# EAGLE design vssb3 (EAGLE 7.1.0)
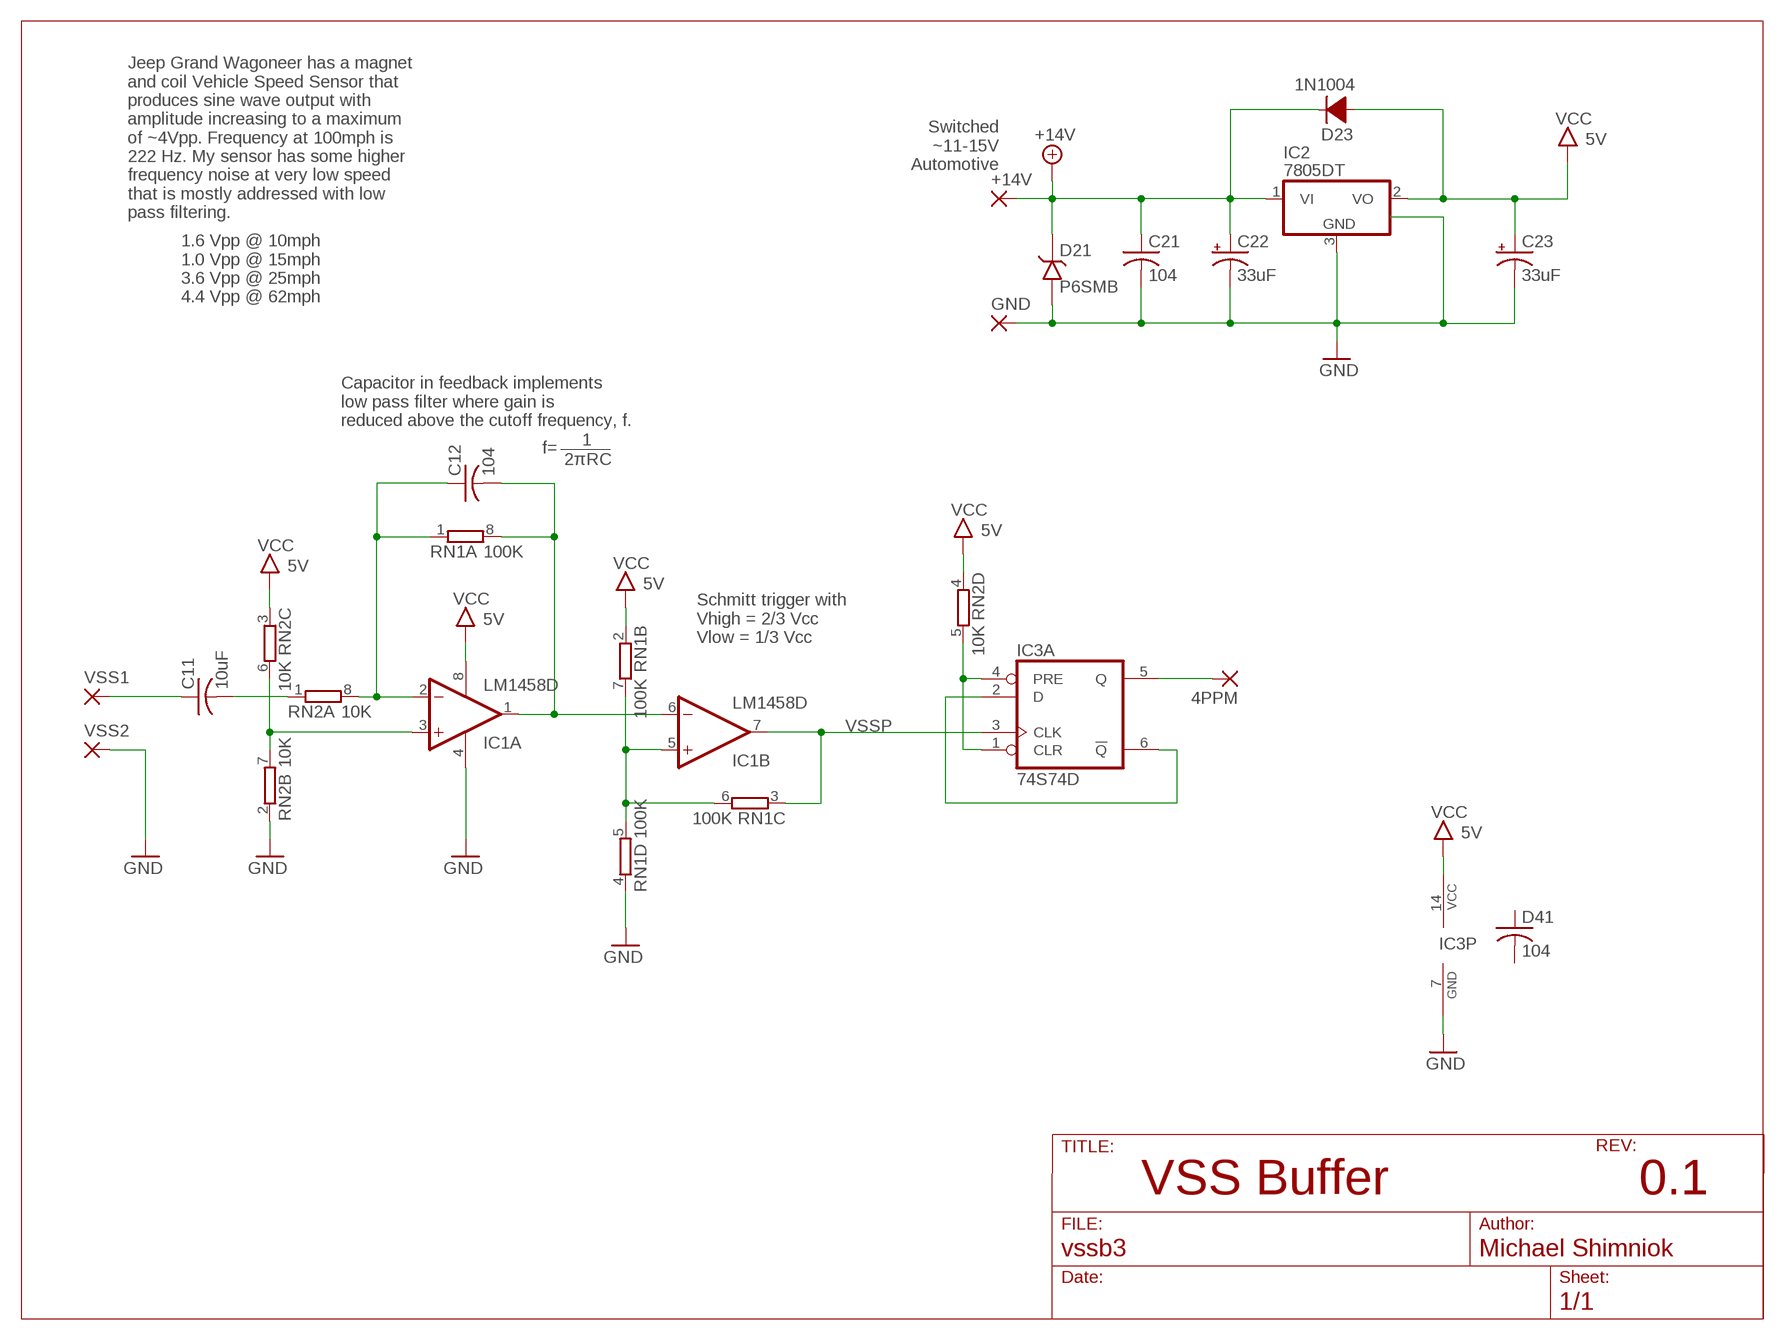
[diagram p0: schematic, sheet 1]

## Parts
4PPM  WIREPAD3,17/1,3  [3,17/1,3]
+14V  WIREPAD3,17/1,3  [3,17/1,3]
C11  10uF  C-USC1206  [C1206]
C12  104  C-USC0603  [C0603]
C21  104  C-USC0603  [C0603]
C22  33uF  CPOL-USSMCB  [SMC_B]
C23  33uF  CPOL-USSMCB  [SMC_B]
D21  P6SMB  P6SMBXXAT3GSMA  [DO-214AA]
D23  1N1004  DIODESMA  [SMA]
D41  104  C-USC0603  [C0603]
GND  WIREPAD3,17/1,3  [3,17/1,3]
IC1  LM1458D  [SO08]
IC2  7805DT  [TO252]
IC3  74S74D  [SO14]
RN1  100K  4R-NEXB38V  [EXB38V]
RN2  10K  4R-NEXB38V  [EXB38V]
VSS1  WIREPAD3,17/1,3  [3,17/1,3]
VSS2  WIREPAD3,17/1,3  [3,17/1,3]

## Nets
4PPM: 4PPM.1(P) IC3.5(A:Q)
+14V: +14V.1(P) C21.1 C22.+ D21.P$1(C) D23.C IC2.1(VI)
GND: C21.2 C22.- C23.- D21.P$2(A) GND.1(P) IC1.4(P:V-) IC2.3(GND) IC3.7(P:GND) RN1.4 RN2.2 VSS2.1(P)
N$1: C11.2 RN2.1
N$2: C12.1 IC1.2(A:-IN) RN1.1 RN2.8
N$3: IC1.3(A:+IN) RN2.6 RN2.7
N$4: IC1.5(B:+IN) RN1.5 RN1.6 RN1.7
N$5: IC3.2(A:D) IC3.6(A:!Q)
N$6: IC3.1(A:CLR) IC3.4(A:PRE) RN2.5
OUT1: C12.2 IC1.1(A:OUT) IC1.6(B:-IN) RN1.8
VCC: C23.+ D23.A IC1.8(P:V+) IC2.2(VO) IC3.14(P:VCC) RN1.2 RN2.3 RN2.4 ; supply symbol labelled 5V
VSS1: C11.1 VSS1.1(P)
VSSP: IC1.7(B:OUT) IC3.3(A:CLK) RN1.3
Unconnected: D41.1 D41.2 IC3.8(B:!Q) IC3.9(B:Q) IC3.10(B:PRE) IC3.11(B:CLK) IC3.12(B:D) IC3.13(B:CLR)

## Notes on the sheet
- Jeep Grand Wagoneer has a magnet 
  and coil Vehicle Speed Sensor that
  produces sine wave output with
  amplitude increasing to a maximum
  of ~4Vpp. Frequency at 100mph is
  222 Hz. My sensor has some higher
  frequency noise at very low speed
  that is mostly addressed with low
  pass filtering.
- Switched
  ~11-15V
  Automotive
- 1.6 Vpp @ 10mph
  1.0 Vpp @ 15mph
  3.6 Vpp @ 25mph
  4.4 Vpp @ 62mph
- Capacitor in feedback implements
  low pass filter where gain is
  reduced above the cutoff frequency, f.
- 1
- f=
- 2πRC
- Schmitt trigger with 
  Vhigh = 2/3 Vcc
  Vlow = 1/3 Vcc
- VSS Buffer | 0.1

## Library data of the parts
4PPM +14V GND VSS1 VSS2 = wirepad:WIREPAD: Wire PAD connect wire on PCB
C11 C12 C21 D41 = rcl:C-US: CAPACITOR, American symbol
C22 C23 = rcl:CPOL-US: POLARIZED CAPACITOR, American symbol
D21 = bt_diode:P6SMBXXAT3G: SMBxxAT3G TVS Diode The SMB series is designed to protect voltage sensitive components from high voltage, high energy transients. They have excellent clamping capability, high surge capability, low zener impedance and fast response time. The SMB series is supplied in ON Semiconductor’s exclusive, cost-effective, highly reliable SURMETIC® package and is ideally suited for use in communication systems, automotive, numerical controls, process controls, medical equipment, business machines, power supplies and many other industrial/consumer applications. http://www.onsemi.com/pub_link/Collateral/P6SMB6.8AT3-D.PDF <datasheet.pdf>
D23 = ads4:DIODE: Diode Contains packages not in Eagle libraries
IC1 = bt_linear:*1458: OP AMP
IC2 = linear:78*: Positive VOLTAGE REGULATOR Source: http://cache.national.com/ds/LM/LM78L05.pdf http://www.fairchildsemi.com/ds/LM/LM7805.pdf
IC3 = 74xx-us:74*74: Dual D type positive edge triggered FLIP FLOP, preset and clear
RN1 RN2 = resistor-dil:4R-N: Array Chip Resistor Source: RS Component / Phycomp; OC_FARNELL: unknown; OC_NEWARK: unknown

## Board
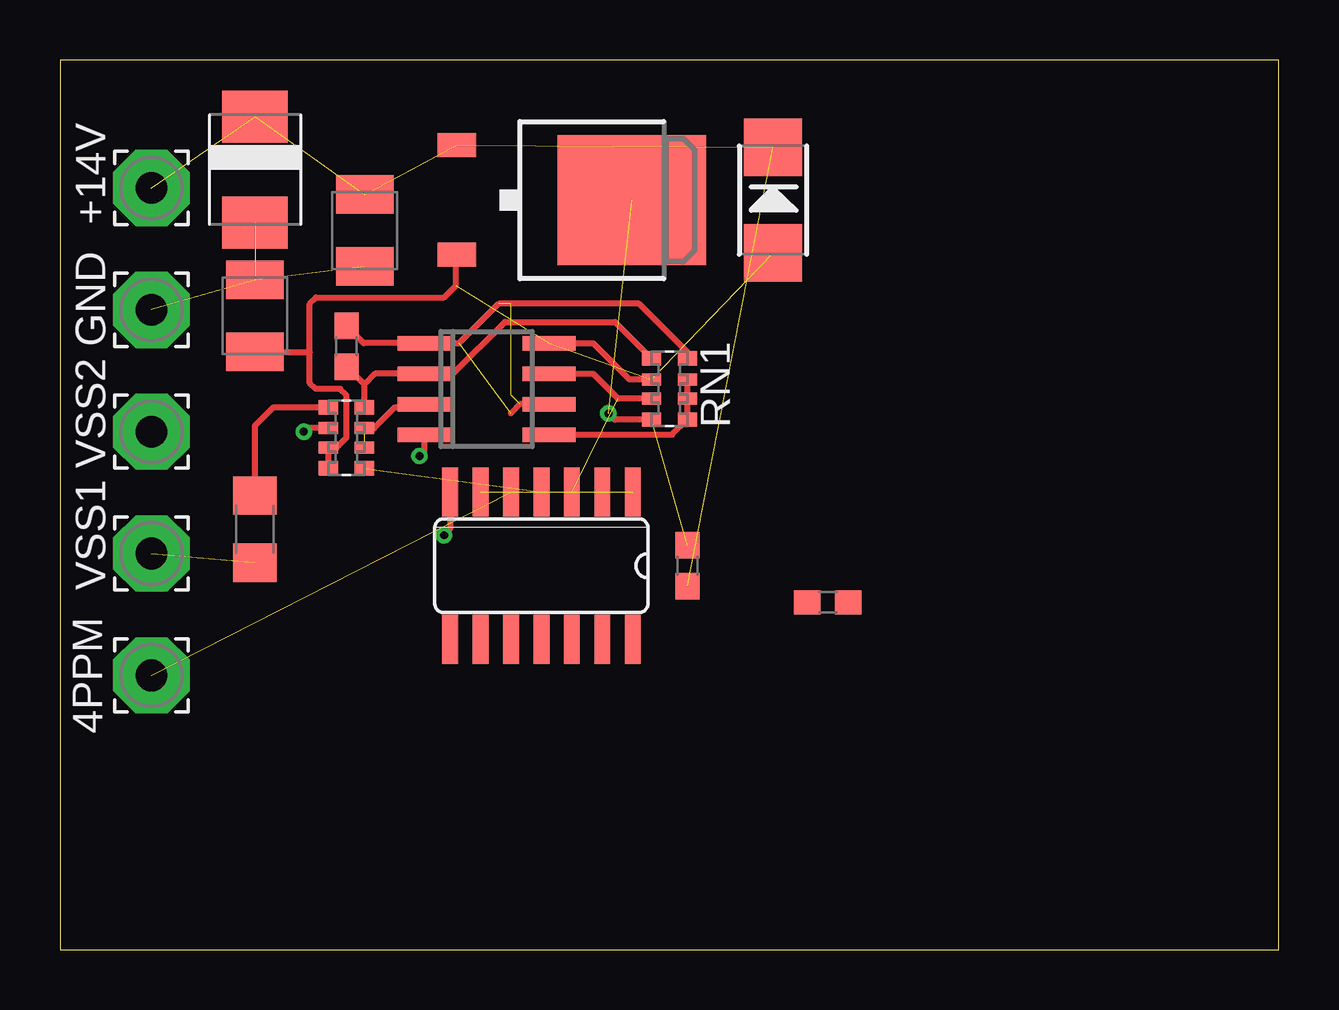
[diagram p1: board, top side]
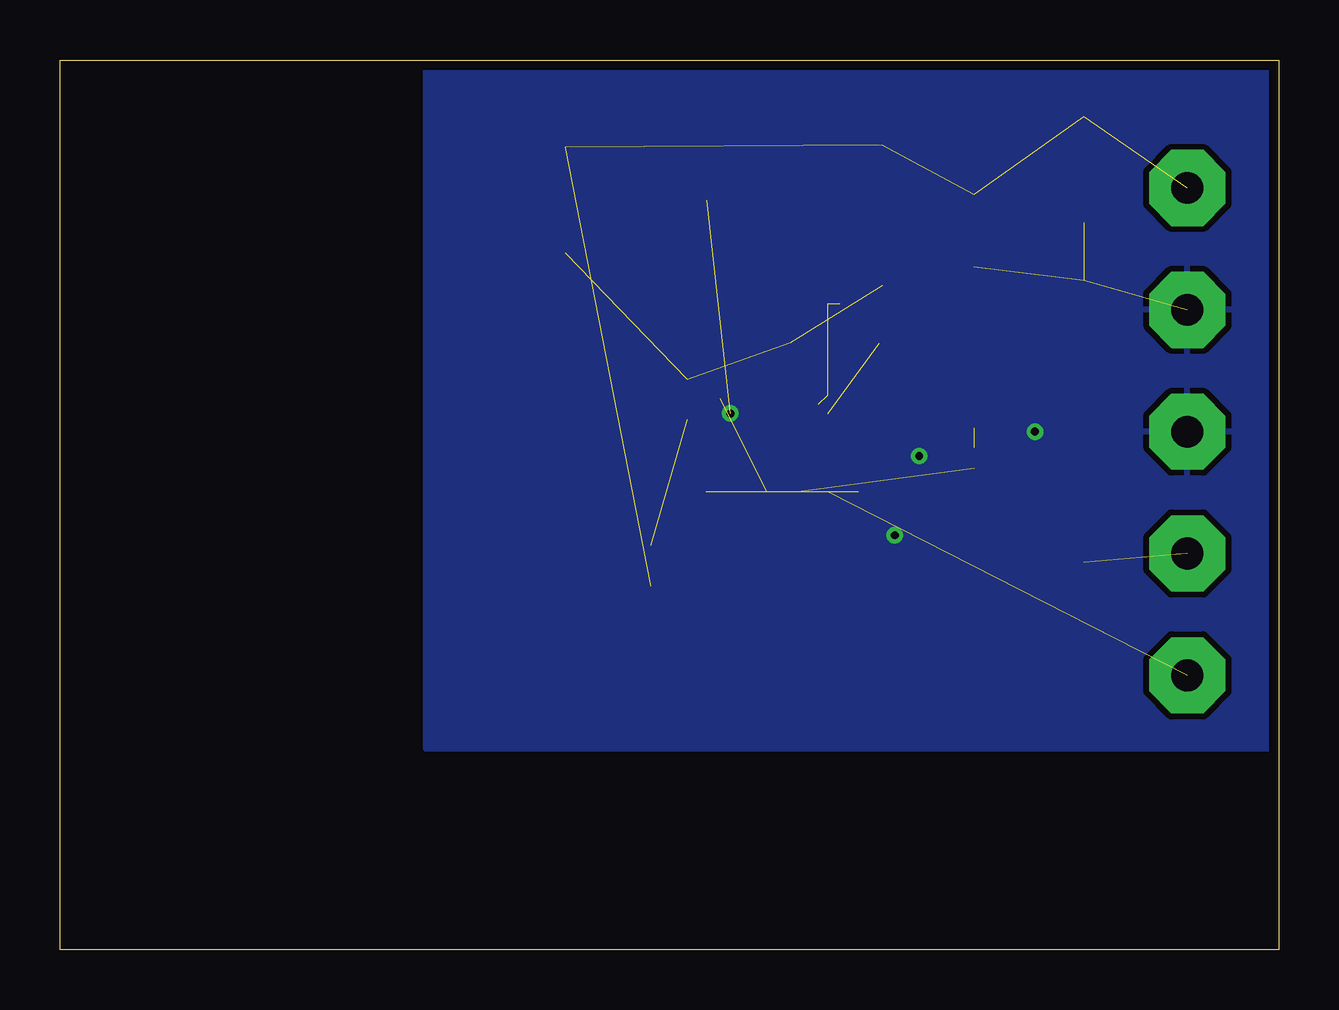
[diagram p2: board, bottom side, seen from below]

Size 50.8 x 37.08 mm. Coordinates in mm from the lower left corner, seen from the top.
Outline: 0,0 50.8,0 50.8,37.08 0,37.08 0,0
Copper layers (1*16): Top 0.0356mm / dielectric 1.5011mm / Bottom 0.0356mm
Design rules "LaenPCBOrder *": minimum track width 6mil, minimum drill 13mil, track to track 10mil, track to pad 10mil, pad to pad 10mil, via to via 10mil, smd to smd 8mil, copper to edge 16mil, drill to drill 16mil, minimum pad ring 7mil, minimum via ring 7mil, stop-mask expansion 3mil, vias tented up to drill 20mil, thermal gap 10mil

### Footprints (pad centres in the part's own frame; a part is rotated, then mirrored left to right if it is on the bottom)
3,17/1,3 = drill 1.321 pad 3.175 octagon: 1 0,0
C1206 = smd 1.6 x 1.8: 1 -1.4,0; 2 1.4,0
C0603 = smd 1.1 x 1: 1 -0.85,0; 2 0.85,0
SMC_B = smd 1.6 x 2.4: + -1.5,0; - 1.5,0
DO-214AA = smd 2.159 x 2.743: P$1 -2.21,0; P$2 2.21,0
SMA = smd 2.4 x 2.4: A 2.2,0; C -2.2,0
SO08 = smd 0.6 x 2.2: 1 -1.905,-2.6; 2 -0.635,-2.6; 3 0.635,-2.6; 4 1.905,-2.6; 5 1.905,2.6; 6 0.635,2.6; 7 -0.635,2.6; 8 -1.905,2.6
TO252 = smd 1 x 1.6: 1 -2.28,-4.8; 2 2.28,-4.8 | smd 5.4 x 6.2: 3 0,2.5
SO14 = smd 0.66 x 2.032: 1 -3.81,-3.073; 2 -2.54,-3.073; 3 -1.27,-3.073; 4 0,-3.073; 5 1.27,-3.073; 6 2.54,-3.073; 7 3.81,-3.073; 8 3.81,3.073; 9 2.54,3.073; 10 1.27,3.073; 11 0,3.073; 12 -1.27,3.073; 13 -2.54,3.073; 14 -3.81,3.073
EXB38V = smd 0.6 x 0.8: 1 -1.275,-0.75; 4 1.275,-0.75; 5 1.275,0.75; 8 -1.275,0.75 | smd 0.5 x 0.8: 2 -0.4,-0.75; 3 0.4,-0.75; 6 0.4,0.75; 7 -0.4,0.75

### Placement (x,y rotation side)
4PPM  3.81,11.43 90 top
+14V  3.81,31.75 90 top
C11  8.13,17.53 90 top
C12  11.94,25.15 90 top
C21  26.16,16 90 top
C22  12.7,29.97 270 top
C23  8.13,26.42 90 top
D21  8.13,32.51 270 top
D23  29.72,31.24 270 top
D41  32,14.48 0 top
GND  3.81,26.67 90 top
IC1  17.78,23.37 270 top
IC2  21.34,31.24 270 top
IC3  20.07,16 180 top
RN1  25.4,23.37 270 top
RN2  11.94,21.34 270 top
VSS1  3.81,16.51 90 top
VSS2  3.81,21.59 90 top

### Tracks (layer width: path | path; a pad name or v marks a point on that pad's centre or on a via)
4PPM  (1 unrouted)
+14V  (5 unrouted)
GND  (via drill 0.33)  (5 unrouted)
  Top 0.254: RN2.2 10.31,21.74 v10.16,21.59 | IC1.4 15.18,20.77 v14.99,20.57 | IC3.7 16.26,17.53 v16,17.27 | RN1.4 23.12,22.09 v22.86,22.35
  pour Bottom: 0,36.83 35.56,36.83 35.56,8.38 0,8.38
N$1
  Top 0.254: C11.2 8.13,21.84 8.64,22.35 8.9,22.61 RN2.1
N$2
  Top 0.254: RN2.8 12.69,23.55 | 12.69,23.55 C12.1 | 12.69,23.55 13.14,24 IC1.2 16.38,24 18.54,26.16 23.13,26.16 RN1.1
N$3  (1 unrouted)
  Top 0.254: RN2.7 13.1,21.74 13.97,22.61 15.05,22.61 IC1.3
N$4
  Top 0.254: IC1.5 25.52,21.46 RN1.5 RN1.6 RN1.7
N$5  (1 unrouted)
N$6  (2 unrouted)
OUT1  (6 unrouted)
  Top 0.254: C12.2 12.66,25.27 IC1.1 16.64,25.27 18.29,26.92 24.13,26.92 26.15,24.9 RN1.8 | IC1.6 19.18,22.73 18.8,22.35
VCC  (3 unrouted)
  Top 0.254: RN2.4 RN2.3 11.54,20.94 11.94,21.34 11.94,23.11 11.68,23.37 10.67,23.37 10.41,23.62 10.41,24.89 | 10.41,24.89 10.41,26.92 10.67,27.18 16,27.18 16.51,27.69 16.51,28.94 IC2.2 | C23.+ 10.39,24.92 10.41,24.89 | RN1.2 23.73,23.77 22.23,25.27 IC1.8
VSS1  (1 unrouted)
VSSP  (1 unrouted)
  Top 0.254: IC1.7 22.23,24 23.26,22.97 RN1.3